# EAGLE schematic v1.1 (EAGLE 7.4.0)
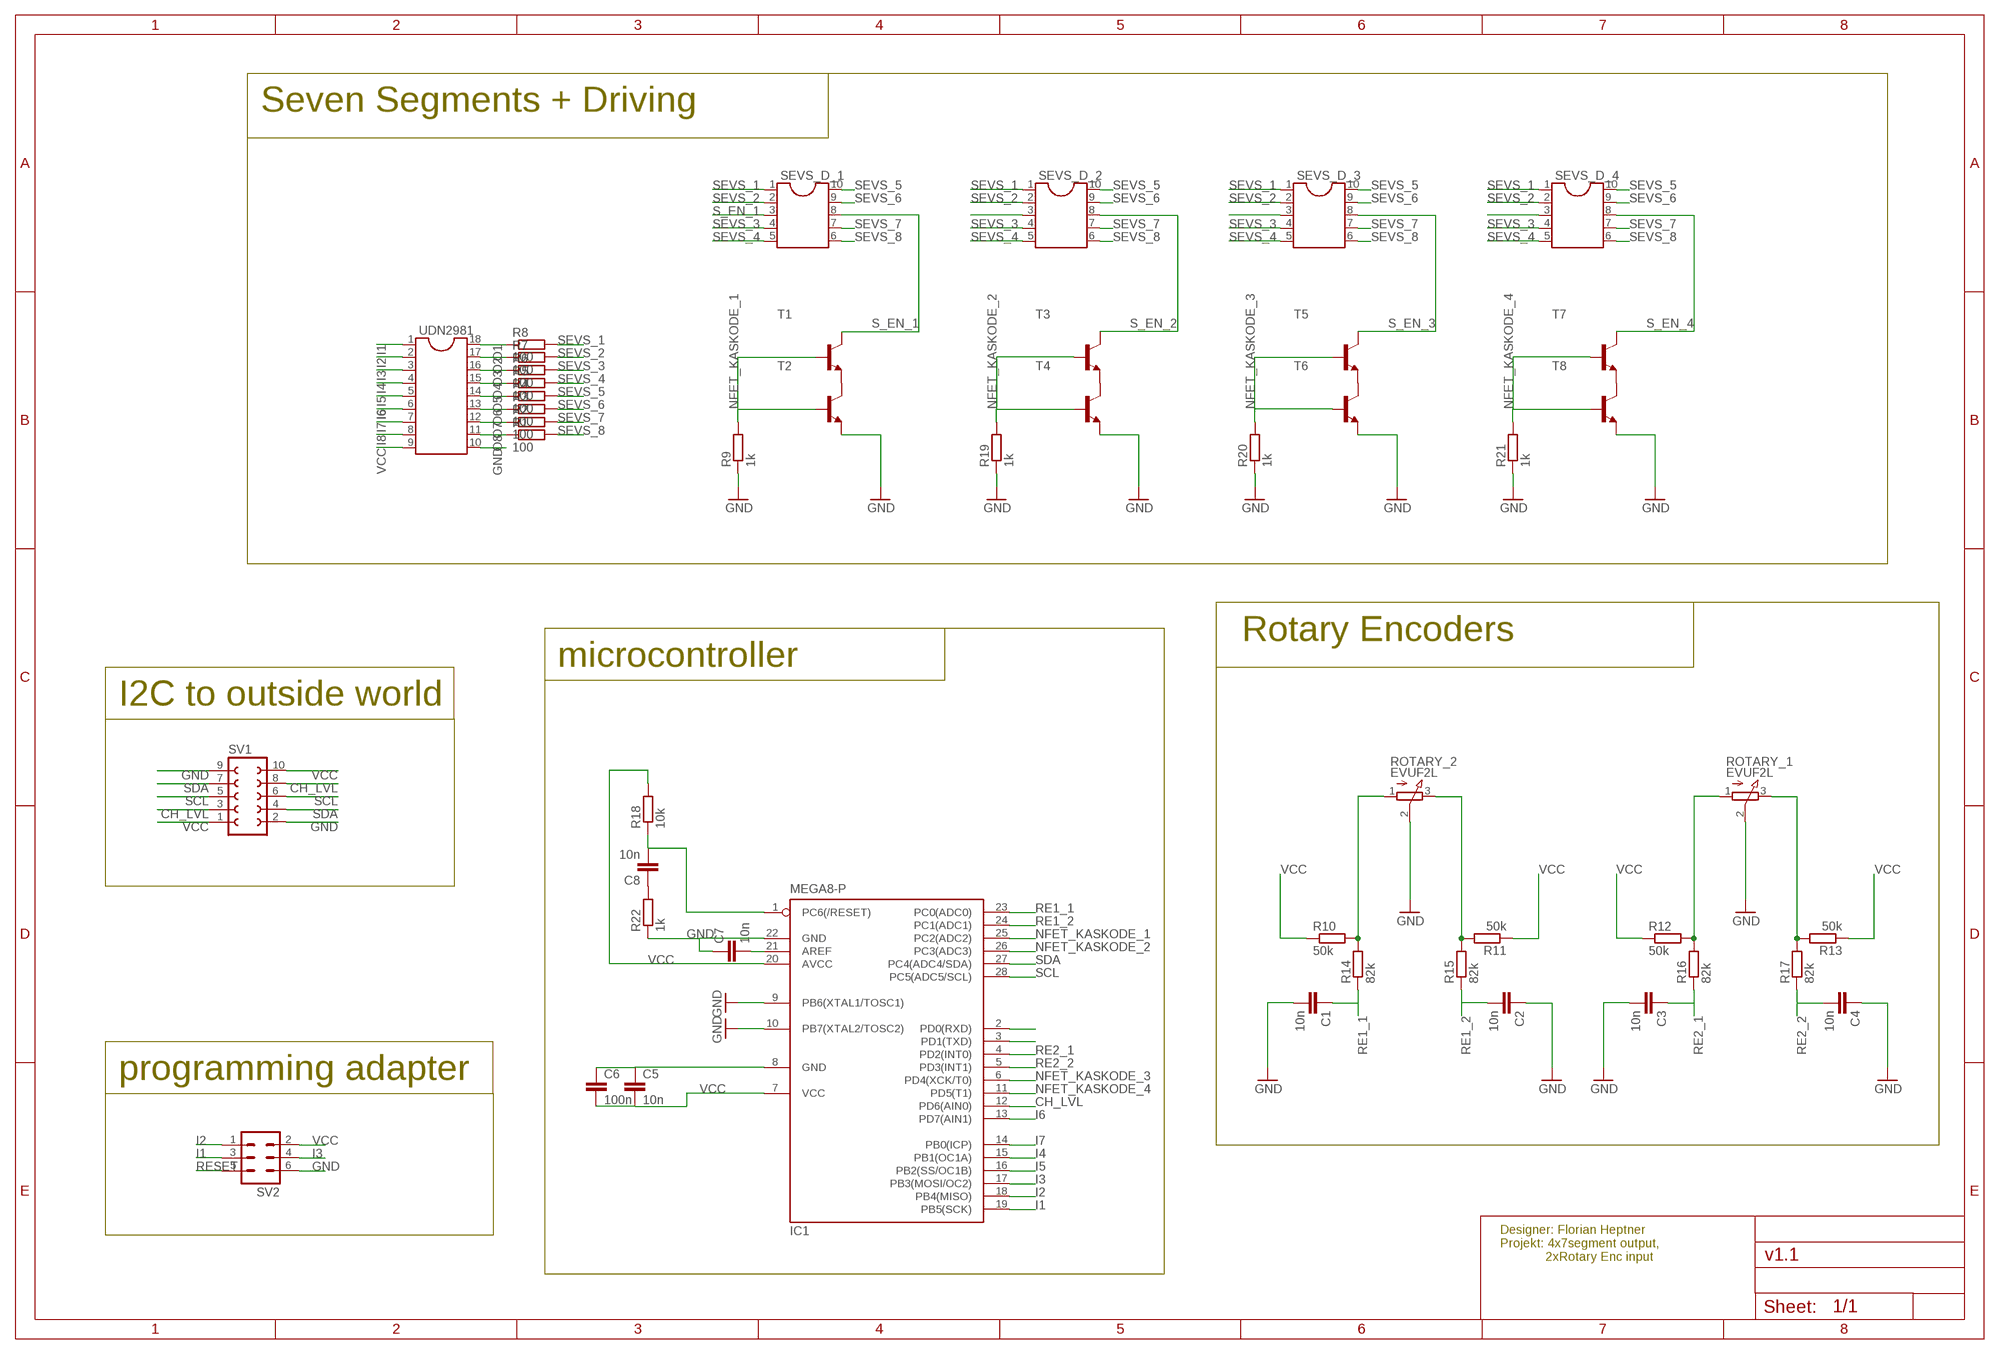
[diagram p0: schematic, sheet 1]

## Parts
C1  10n  C2,5-3  [C2.5-3]
C2  10n  C2,5-3  [C2.5-3]
C3  10n  C2,5-3  [C2.5-3]
C4  10n  C2,5-3  [C2.5-3]
C5  10n  C2,5-3  [C2.5-3]
C6  100n  C2,5-3  [C2.5-3]
C7  10n  C2,5-3  [C2.5-3]
C8  10n  C2,5-3  [C2.5-3]
IC1  MEGA8-P  [DIL28-3]
R1  100  R-EU_0207/10  [0207/10]
R2  100  R-EU_0207/10  [0207/10]
R3  100  R-EU_0207/10  [0207/10]
R4  100  R-EU_0207/10  [0207/10]
R5  100  R-EU_0207/10  [0207/10]
R6  100  R-EU_0207/10  [0207/10]
R7  100  R-EU_0207/10  [0207/10]
R8  100  R-EU_0207/10  [0207/10]
R9  1k  R-EU_0207/10  [0207/10]
R10  50k  R-EU_0207/10  [0207/10]
R11  50k  R-EU_0207/10  [0207/10]
R12  50k  R-EU_0207/10  [0207/10]
R13  50k  R-EU_0207/10  [0207/10]
R14  82k  R-EU_0207/10  [0207/10]
R15  82k  R-EU_0207/10  [0207/10]
R16  82k  R-EU_0207/10  [0207/10]
R17  82k  R-EU_0207/10  [0207/10]
R18  10k  R-EU_0207/10  [0207/10]
R19  1k  R-EU_0207/10  [0207/10]
R20  1k  R-EU_0207/10  [0207/10]
R21  1k  R-EU_0207/10  [0207/10]
R22  1k  R-EU_0207/10  [0207/10]
ROTARY_1  EVUF2L  [EVUFXL]
ROTARY_2  EVUF2L  [EVUFXL]
SEVS_D_1  DIL10  [DIL10]
SEVS_D_2  DIL10  [DIL10]
SEVS_D_3  DIL10  [DIL10]
SEVS_D_4  DIL10  [DIL10]
SV1  FE05-2  [FE05-2]
SV2  ML6  [ML6]
T1  -NPN-TO92-CBE  [TO92-CBE]
T2  -NPN-TO92-CBE  [TO92-CBE]
T3  -NPN-TO92-CBE  [TO92-CBE]
T4  -NPN-TO92-CBE  [TO92-CBE]
T5  -NPN-TO92-CBE  [TO92-CBE]
T6  -NPN-TO92-CBE  [TO92-CBE]
T7  -NPN-TO92-CBE  [TO92-CBE]
T8  -NPN-TO92-CBE  [TO92-CBE]
UDN2981  DIL18  [DIL18]

## Nets
CH_LVL: IC1.12(PD6(AIN0)) SV1.3 SV1.8
GND: C1.2 C2.1 C3.2 C4.1 C7.1 IC1.9(PB6(XTAL1/TOSC1)) IC1.10(PB7(XTAL2/TOSC2)) IC1.22(GND) R9.1 R19.1 R20.1 R21.1 R22.1 ROTARY_1.2(S) ROTARY_2.2(S) SV1.2 SV1.9 SV2.6 T2.E T4.E T6.E T8.E UDN2981.10
I1: IC1.19(PB5(SCK)) SV2.3 UDN2981.1
I2: IC1.18(PB4(MISO)) SV2.1 UDN2981.2
I3: IC1.17(PB3(MOSI/OC2)) SV2.4 UDN2981.3
I4: IC1.15(PB1(OC1A)) UDN2981.4
I5: IC1.16(PB2(SS/OC1B)) UDN2981.5
I6: IC1.13(PD7(AIN1)) UDN2981.6
I7: IC1.14(PB0(ICP)) UDN2981.7
I8: UDN2981.8
N$1: R11.2 R15.2 ROTARY_2.3(E)
N$2: C8.1 R22.2
N$3: IC1.3(PD1(TXD))
N$4: R10.2 R14.2 ROTARY_2.1(A)
N$5: R12.2 R16.2 ROTARY_1.1(A)
N$6: R13.2 R17.2 ROTARY_1.3(E)
N$7: T1.E T2.C
N$8: T3.E T4.C
N$9: T5.E T6.C
N$10: T7.E T8.C
N$11: IC1.2(PD0(RXD))
N$12: C5.1 C6.1 IC1.8(GND)
N$15: C7.2 IC1.21(AREF)
NFET_KASKODE_1: IC1.25(PC2(ADC2)) R9.2 T1.B T2.B
NFET_KASKODE_2: IC1.26(PC3(ADC3)) R19.2 T3.B T4.B
NFET_KASKODE_3: IC1.6(PD4(XCK/T0)) R20.2 T5.B T6.B
NFET_KASKODE_4: IC1.11(PD5(T1)) R21.2 T7.B T8.B
O1: R8.1 UDN2981.18
O2: R7.1 UDN2981.17
O3: R6.1 UDN2981.16
O4: R5.1 UDN2981.15
O5: R4.1 UDN2981.14
O6: R3.1 UDN2981.13
O7: R2.1 UDN2981.12
O8: R1.1 UDN2981.11
RE1_1: C1.1 IC1.23(PC0(ADC0)) R14.1
RE1_2: C2.2 IC1.24(PC1(ADC1)) R15.1
RE2_1: C3.1 IC1.4(PD2(INT0)) R16.1
RE2_2: C4.2 IC1.5(PD3(INT1)) R17.1
RESET: C8.2 IC1.1(PC6(/RESET)) R18.1 SV2.5
S_EN_1: SEVS_D_1.3 SEVS_D_1.8 T1.C
S_EN_2: SEVS_D_2.3 SEVS_D_2.8 T3.C
S_EN_3: SEVS_D_3.3 SEVS_D_3.8 T5.C
S_EN_4: SEVS_D_4.3 SEVS_D_4.8 T7.C
SCL: IC1.28(PC5(ADC5/SCL)) SV1.5 SV1.6
SDA: IC1.27(PC4(ADC4/SDA)) SV1.4 SV1.7
SEVS_1: R8.2 SEVS_D_1.1 SEVS_D_2.1 SEVS_D_3.1 SEVS_D_4.1
SEVS_2: R7.2 SEVS_D_1.2 SEVS_D_2.2 SEVS_D_3.2 SEVS_D_4.2
SEVS_3: R6.2 SEVS_D_1.4 SEVS_D_2.4 SEVS_D_3.4 SEVS_D_4.4
SEVS_4: R5.2 SEVS_D_1.5 SEVS_D_2.5 SEVS_D_3.5 SEVS_D_4.5
SEVS_5: R4.2 SEVS_D_1.10 SEVS_D_2.10 SEVS_D_3.10 SEVS_D_4.10
SEVS_6: R3.2 SEVS_D_1.9 SEVS_D_2.9 SEVS_D_3.9 SEVS_D_4.9
SEVS_7: R2.2 SEVS_D_1.7 SEVS_D_2.7 SEVS_D_3.7 SEVS_D_4.7
SEVS_8: R1.2 SEVS_D_1.6 SEVS_D_2.6 SEVS_D_3.6 SEVS_D_4.6
VCC: C5.2 C6.2 IC1.7(VCC) IC1.20(AVCC) R10.1 R11.1 R12.1 R13.1 R18.2 SV1.1 SV1.10 SV2.2 UDN2981.9

## Notes on the sheet
- Seven Segments + Driving
- Rotary Encoders
- microcontroller
- I2C to outside world
- programming adapter
- Designer: Florian Heptner
  Projekt: 4x7segment output,
               2xRotary Enc input

## Library data of the parts
C1-C8 = capacitor-wima:C: CAPACITOR naming: grid - package width
IC1 = atmel:MEGA8-P: MICROCONTROLLER 8 Kbytes FLASH, 1 kbytes SRAM, 512 bytes EEPROM, USART, 4-channel 10 bit ADC, 2-channel 8 bit ADC Pin compatible with Atmega48, ATMega88, ATMega168 Source: avr.lbr; OC_FARNELL: unknown; OC_NEWARK: unknown
R1-R22 = rcl:R-EU_: RESISTOR, European symbol
ROTARY_1 ROTARY_2 = pot:EVU: 9 mm Square Rotary Potentiometers Source: Panasonic
SEVS_D_1-SEVS_D_4 = ic-package:DIL10: Dual In Line / Socket
SV1 = con-lsta:FE05-2: FEMALE HEADER; OC_FARNELL: unknown; OC_NEWARK: unknown
SV2 = con-harting-ml:ML6: HARTING; OC_FARNELL: unknown; OC_NEWARK: unknown
T1-T8 = transistor-neu-to92:*-NPN-: NPN Transistror
UDN2981 = ic-package:DIL18: Dual In Line / Socket